# Altium schematic sheet MICROCONTROLER.SchDoc
size A4; SheetNumber: 3; SheetTotal: 10
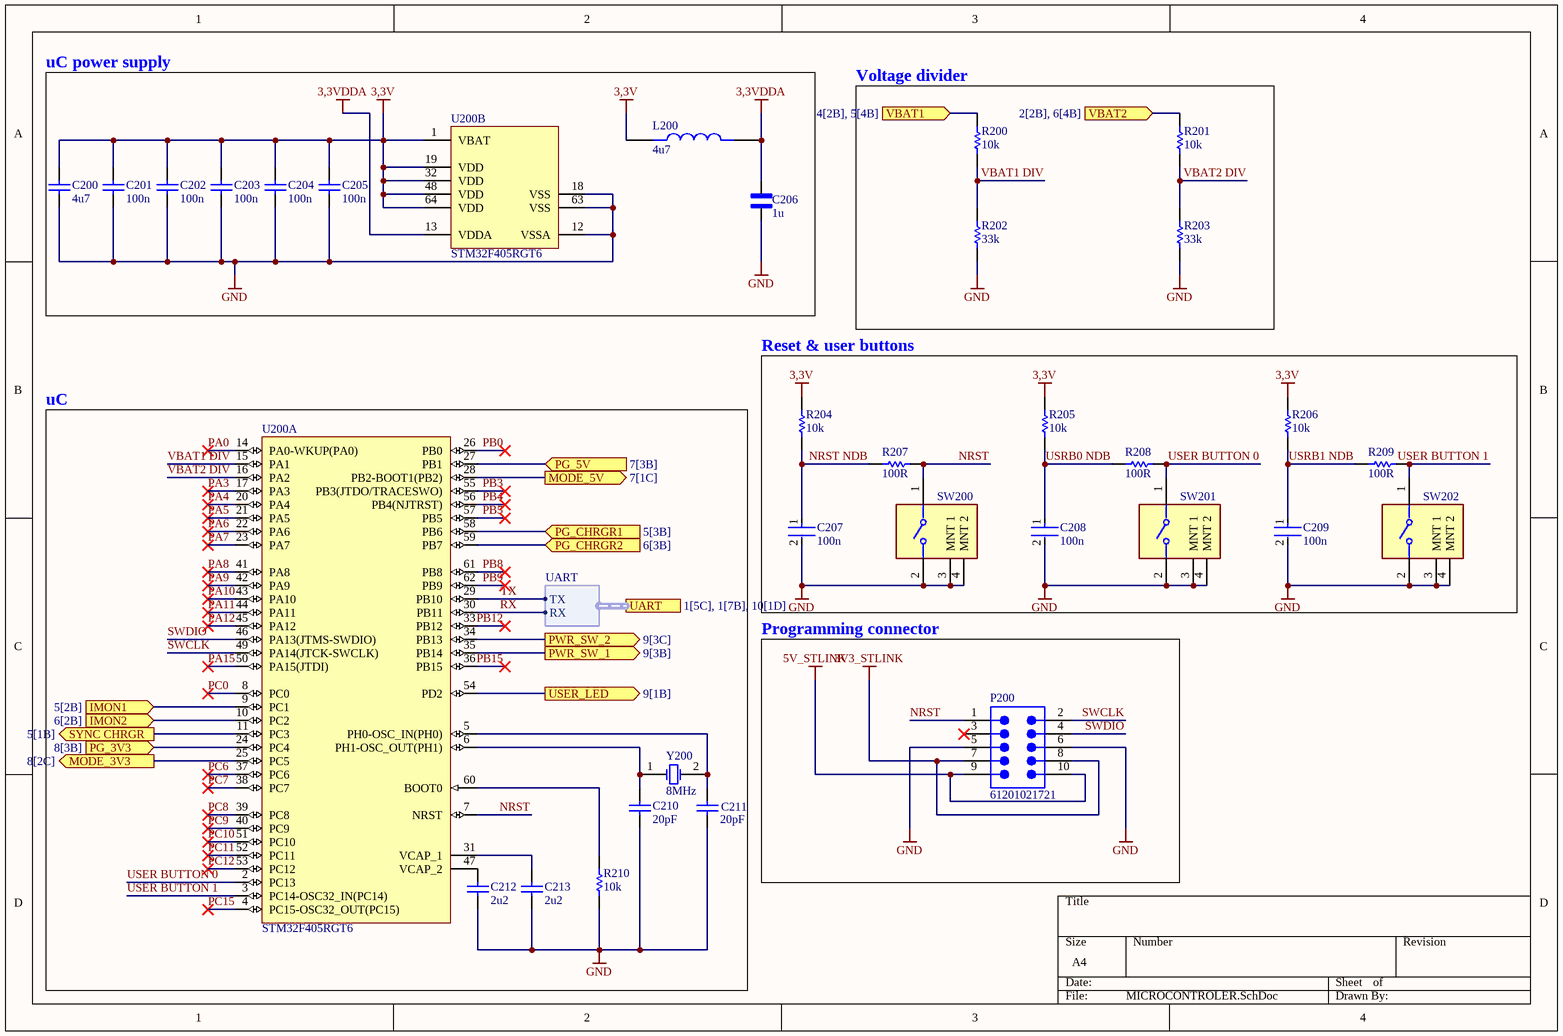
[diagram p0: MICROCONTROLER.SchDoc]

## Parts
C200  4u7  [CAPC1005X55X30LL05T10]
C201  100n  [CAPC1005X55X30LL05T10]
C202  100n  [CAPC1005X55X30LL05T10]
C203  100n  [CAPC1005X55X30LL05T10]
C204  100n  [CAPC1005X55X30LL05T10]
C205  100n  [CAPC1005X55X30LL05T10]
C206  1u  [CAPC1005X70N]
C207  100n  [FP-C0402-BB-MFG]
C208  100n  [FP-C0402-BB-MFG]
C209  100n  [FP-C0402-BB-MFG]
C210  20pF  [tu 0805]
C211  20pF  [tu 0805]
C212  2u2  [tu 0805]
C213  2u2  [tu 0805]
L200  4u7  [INDC2012X100N]
P200  61201021721  [61201021721]
R200  10k  [RESC1609X50X30NL8T20]
R201  10k  [RESC1609X50X30NL8T20]
R202  33k  [RESC1005X40X25ML05T10]
R203  33k  [RESC1005X40X25ML05T10]
R204  10k  [RESC1609X50X30NL8T20]
R205  10k  [RESC1609X50X30NL8T20]
R206  10k  [RESC1609X50X30NL8T20]
R207  100R  [RESC1005X40X25ML05T10]
R208  100R  [RESC1005X40X25ML05T10]
R209  100R  [RESC1005X40X25ML05T10]
R210  10k  [RESC1609X50X30NL8T20]
SW200  B3F-3152  [FP-B3F-3152-MFG]  (value not drawn)
SW201  B3F-3152  [FP-B3F-3152-MFG]  (value not drawn)
SW202  B3F-3152  [FP-B3F-3152-MFG]  (value not drawn)
U200  STM32F405RGT6  [STM-LQFP64_N]  (parts A,B of 2)
Y200  8MHz  [ABRA-ABLS-14.7456MHZ-B2-T_V]

## Blocks framed on the sheet
uC power supply: C200-C206 L200 U200
Voltage divider: R200-R203
uC: C210-C213 R210 U200 Y200
Reset & user buttons: C207-C209 R204-R209 SW200-SW202
Programming connector: P200

## Ports
IMON1 (in, see 5[2B]), IMON2 (in, see 6[2B]), MODE_3V3 (out, see 8[2C]), MODE_5V (out, see 7[1C]), PG_3V3 (in, see 8[3B]), PG_5V (in, see 7[3B]), PG_CHRGR1 (in, see 5[3B]), PG_CHRGR2 (in, see 6[3B]), PWR_SW_1 (out, see 9[3B]), PWR_SW_2 (out, see 9[3C]), SYNC CHRGR (out, see 5[1B]), UART (harness UART, see 1[5C], 1[7B], 10[1D]), USER_LED (out, see 9[1B]), VBAT1 (in, see 4[2B], 5[4B]), VBAT2 (in, see 2[2B], 6[4B])

## Harnesses
UART: TX, RX

## Nets
3,3V: C200.2 C201.2 C202.2 C203.2 C204.2 C205.2 L200.1 R204.2 R205.2 R206.2 U200.1(VBAT) U200.19(VDD) U200.32(VDD) U200.48(VDD) U200.64(VDD)
3,3VDDA: C206.2 L200.2 U200.13(VDDA)
3V3_STLINK: P200.7 P200.8
5V_STLINK: P200.9 P200.10
GND: C200.1 C201.1 C202.1 C203.1 C204.1 C205.1 C206.1 C207.2 C208.2 C209.2 C210.2 C211.2 C212.2 C213.2 P200.5 P200.6 R202.1 R203.1 R210.1 SW200.2 SW200.3(MNT_1) SW200.4(MNT_2) SW201.2 SW201.3(MNT_1) SW201.4(MNT_2) SW202.2 SW202.3(MNT_1) SW202.4(MNT_2) U200.12(VSSA) U200.18(VSS) U200.63(VSS)
IMON1: U200.9(PC1) ; port IMON1
IMON2: U200.10(PC2) ; port IMON2
MODE_3V3: U200.25(PC5) ; port MODE_3V3
MODE_5V: U200.28(PB2-BOOT1(PB2)) ; port MODE_5V
NRST: P200.1 R207.2 SW200.1 U200.7(NRST)
NRST NDB: C207.1 R204.1 R207.1
PA0: U200.14(PA0-WKUP(PA0))
PA3: U200.17(PA3)
PA4: U200.20(PA4)
PA5: U200.21(PA5)
PA6: U200.22(PA6)
PA7: U200.23(PA7)
PA8: U200.41(PA8)
PA9: U200.42(PA9)
PA10: U200.43(PA10)
PA11: U200.44(PA11)
PA12: U200.45(PA12)
PA15: U200.50(PA15(JTDI))
PB0: U200.26(PB0)
PB3: U200.55(PB3(JTDO/TRACESWO))
PB4: U200.56(PB4(NJTRST))
PB5: U200.57(PB5)
PB8: U200.61(PB8)
PB9: U200.62(PB9)
PB12: U200.33(PB12)
PB15: U200.36(PB15)
PC0: U200.8(PC0)
PC6: U200.37(PC6)
PC7: U200.38(PC7)
PC8: U200.39(PC8)
PC9: U200.40(PC9)
PC10: U200.51(PC10)
PC11: U200.52(PC11)
PC12: U200.53(PC12)
PC15: U200.4(PC15-OSC32_OUT(PC15))
PG_3V3: U200.24(PC4) ; port PG_3V3
PG_5V: U200.27(PB1) ; port PG_5V
PG_CHRGR1: U200.58(PB6) ; port PG_CHRGR1
PG_CHRGR2: U200.59(PB7) ; port PG_CHRGR2
PWR_SW_1: U200.35(PB14) ; port PWR_SW_1
PWR_SW_2: U200.34(PB13) ; port PWR_SW_2
RX: U200.30(PB11) ; port UART.RX
SWCLK: P200.2 U200.49(PA14(JTCK-SWCLK))
SWDIO: P200.4 U200.46(PA13(JTMS-SWDIO))
SYNC CHRGR: U200.11(PC3) ; port SYNC CHRGR
TX: U200.29(PB10) ; port UART.TX
USER BUTTON 0: R208.2 SW201.1 U200.2(PC13)
USER BUTTON 1: R209.2 SW202.1 U200.3(PC14-OSC32_IN(PC14))
USER_LED: U200.54(PD2) ; port USER_LED
USRB0 NDB: C208.1 R205.1 R208.1
USRB1 NDB: C209.1 R206.1 R209.1
VBAT1: R200.2 ; port VBAT1
VBAT1 DIV: R200.1 R202.2 U200.15(PA1)
VBAT2: R201.2 ; port VBAT2
VBAT2 DIV: R201.1 R203.2 U200.16(PA2)
NetC210_1: C210.1 U200.6(PH1-OSC_OUT(PH1)) Y200.1(X1)
NetC211_1: C211.1 U200.5(PH0-OSC_IN(PH0)) Y200.2(X2)
NetC212_1: C212.1 U200.47(VCAP_2)
NetC213_1: C213.1 U200.31(VCAP_1)
NetR210_2: R210.2 U200.60(BOOT0)

Not connected (* = marked no-connect by the designer): P200 3*

## Library data of the parts
C200-C205 = CMP-0001-00074-2: Manufacturer: Kemet; Part Number: C0402C104K4RACTU
C206 = MAASL105CD7105MFCA01: MF: Taiyo Yuden; SnapEDA_Link: https://www.snapeda.com/parts/MAASL105CD7105MFCA01/Littelfuse/view-part/?ref=snap; Package: None; Value: *; MP: MAASL105CD7105MFCA01; Check_prices: https://www.snapeda.com/parts/MAASL105CD7105MFCA01/Littelfuse/view-part/?ref=eda
C207-C209 = CMP-2008-02046-2: CAP CER 0.1UF 10V X5R 0402; Manufacturer: Kemet; Manufacturer Part Number: C0402C104K8PACTU; Material: Ceramic; Capacitance: 0.10 μF; Temperature Coefficient: 15%; Tolerance: 0.1; Value: 0.10 μF; Package: C0402-BB; Temperature: -55°C to +125°C; ComponentLink2Description: Datasheet; Temperature Characteristic: X5R; Device Class L1: Passive Components; Height: 0.55mm; Lead Free: Yes; ComponentLink2URL: https://content.kemet.com/datasheets/KEM_C1002_X7R_SMD.pdf; Device Class L2: Capacitors; Temperature Range Low: -55°C; Temperature Range High: +125°C; RoHS: TRUE; Octopart: https://octopart.com/c0402c104k8pactu-kemet-140039; Automotive: No; Mouser Description: Capacitor 100 nF 10 VDC 0402; Category: Cap; Voltage Rating: 10 V; Digikey Description: CAP CER 0.1UF 10V X5R 0402; Ipc Land Pattern Name: CAPC10050X50; Device Class L3: Ceramic Capacitors
C210 C211 = Tu 0805 20pF 50V 10%: Dán; Don_Vi: Con; Ten_Linh_Kien: Tụ 0805 20P 10% 50V; So_Chan: 2; Ma_Hang: MH004558; Chung_Loai: Dán; Kieu_Chan: *
C212 C213 = Tu 0805 225 25V 10%: Dán; Don_Vi: Con; So_Chan: 2; Ten_Linh_Kien: Tụ 0805 225-2.2uF 25V 10%; Ma_Hang: MH007483; Chung_Loai: Dán; Kieu_Chan: *
L200 = MLP2012S4R7MT0S1: Surface Mount High Frequency Inductor, MLP Series, 4.7 H, 20%, 0805 [2012 Metric], 0.26 ohm; MF: TDK; Package: 2012 TDK; Price: None; Check_prices: https://www.snapeda.com/parts/MLP2012S4R7MT0S1/TDK/view-part/?ref=eda; Value: *; SnapEDA_Link: https://www.snapeda.com/parts/MLP2012S4R7MT0S1/TDK/view-part/?ref=snap; MP: MLP2012S4R7MT0S1; Availability: In Stock; Purchase-URL: https://pricing.snapeda.com/search/part/MLP2012S4R7MT0S1/?ref=eda
P200 = CMP-1502-00021-2: NexarPartId: 8917787; Operating Supply Voltage: 250V; Number of Positions: 10; Contact Resistance: 20mΩ; Connector Type: Male Pin; Current Rating: 3A; Pitch: 2.54mm; Gender: Male; Insulation Resistance: 1GΩ; Insulation: Insulated; Max Operating Temperature: 105°C; Flammability Rating: UL94 V-0; Mount: Through Hole; Contact Material: Copper; Min Operating Temperature: -40°C; Length: 20.36mm; Number of Contacts: 10; Height: 8.85mm; Number of Rows: 2; Housing Material: PBT; Color: Black; Contact Gender: Male; Orientation: Right Angle; Contact Plating: Gold; Number of Pins: 10; Voltage Rating (DC): 250V; RoHS: Compliant; Insulation Material: PBT; REACH SVHC: Unknown; Row Spacing: 2.54mm; Voltage Rating: 250V; Width: 20.36mm; Lead Pitch: 2.54mm; Termination: Through Hole
R200 R201 R204-R206 R210 = CMP-1666-00005-4: Chip Resistor, 10 KOhm, +/- 1%, 100 mW, -55 to 155 degC, 0603 (1608 Metric), RoHS, Tape and Reel; Manufacturer: Vishay Semiconductor; Voltage Rating: 75 V; Max Operating Temperature: 155 degC; PackageDescription: 2-Pin Surface Mount Device, Body 1.575 x 0.85 mm; ComponentLink1Description: Manufacturer URL; RoHSCompliant: true; PackageReference: 0603; REACH SVHC: Unknown; Length: 1.55 mm; DatasheetVersion: 06/2012; Packaging: Tape and Reel; Min Operating Temperature: -55 degC; Mounting Technology: Surface Mount; ComponentLink2URL: https://datasheet.ciiva.com/11809/0900766b80d98afc-11809037.pdf; Height: 0.45 mm; ComponentLink2Description: Datasheet; Package Quantity: 5000; ComponentLink1URL: http://www.vishay.com/
R202 R203 = CMP-2002-07617-1: Part Number: RC0402FR-0733KL; Manufacturer: Yageo / Phycomp
R207-R209 = CMP-2002-07344-1: Part Number: RC0402FR-07100RL; Manufacturer: Yageo / Phycomp
SW200-SW202 = CMP-08834-000033-1: SWITCH TACTILE SPST-NO 0.05A 24V; Mechanical Life: 300000Cycles; Max Current Rating: 50mA; Illumination Type: Non-Illuminated; Actuator Color: Yellow; Throw Configuration: SPST; Switch Function: Off-Mom; Ratings: IP00; Switch Travel: 0.25mm; Actuator Type: PLUNGER; Contact Resistance: 100mR; Number of Poles: 1; Operating Force: 1.47N; Height: 6.15mm; Contact Plating: Gold; Contact Type: 1 maker; Termination: PC Pins; Radiation Hardening: No; Contact Material: Gold; Number of Pins: 4; Length: 7.3mm; Width: 6mm; Weight: 0.25g; Packaging: Bulk; Contact Current Rating: 50mA; Max Operating Temperature: 70°C; Lead Free: Lead Free; Mount: Through Hole; RoHS Compliant: Yes; Series: B3F; Orientation: Right Angle; Package Quantity: 1000; Current Rating: 50mA; Max Voltage Rating (DC): 24V; Min Operating Temperature: -25°C; Electrical Life: 300000Cycles; Depth: 7.15mm; Voltage Rating (DC): 24V
U200 = CMP-0243-00019-3: ARM Cortex-M4 32-bit MCU+FPU, 210 DMIPS, 1024 kB Flash, 192 kB Internal RAM, 51 I/Os, 64-pin LQFP, -40 to 85 degC, Tray; Manufacturer: STMicroelectronics; Supply Voltage(Vcc) min (V): 1.8; Supply Voltage(Vcc) max (V): 3.6; Internal RAM Size (kB): 192; I/Os (High Current): 51; D/A Converter: 2x12-bit; FLASH Size (Prog) (kB): 1024; Operating Frequency(F) (Processor speed) (MHz): 168; ComponentLink2Description: Datasheet; PackageVersion: Rev. 4, 06/2013; DatasheetVersion: Rev. 4; Core: ARM Cortex-M4; ComponentLink2URL: http://www.st.com/st-web-ui/static/active/en/resource/technical/document/datasheet/DM00037051.pdf; PackageReference: LQFP64; Packing: Tray; ComponentLink1Description: Manufacturer URL; ComponentLink3URL: http://www.st.com/st-web-ui/static/active/en/resource/technical/document/datasheet/DM00037051.pdf; ComponentLink3Description: Package Specification; Mounting Technology: Surface Mount; ComponentLink1URL: http://www.st.com/web/en/home.html; PackageDescription: 64-Pin Low Profile Quad Flat Package, 10 x 10 mm Body, 0.5 mm Pitch; PartNumber: STM32F405RGT6
Y200 = CMP-2000-05726-1: Low Profile Crystal, 8.0 MHz, +/- 30 ppm, -20 to 70 degC, 2-Pin SMD, RoHS, Tape and Reel; Brand: ABRACON; Case Length: 11.4mm; Frequency Stability: 50PPM; ESR: 80Ohms; Case Height: 4.2mm; Tolerance: 30PPM; Case Width: 4.7mm; Load Capacitance: 18pF; Datasheet Version: 04/2011; Termination Style: SMD/SMT; Dimensions: 4.7mmWx11.4mmLx4.2mmH; Packaging: Reel; Manufacturer: ABRACON; Package URL: http://www.abracon.com/Support/PackageDrawing/Resonators/ABLS-2D.pdf; Mounting Technology: SurfaceMount; Package Reference: ABLS-14.7456MHZ-B2-T; Product Category: Crystals; Package Description: 2-Pin Surface Mount Device, Body 11.4 x 4.7 mm; Package / Case: HC-49/US; Mounting Style: SMD/SMT; Operating Temperature Range: -20Cto+70C; Series: ABLS; Frequency: 8MHz; Factory Pack Quantity: 1000; Datasheet URL: http://www.abracon.com/Resonators/abls.pdf; Manufacturer URL: http://www.abracon.com/; RoHS: Details; Type: LowProfileMicroprocessorCrystal